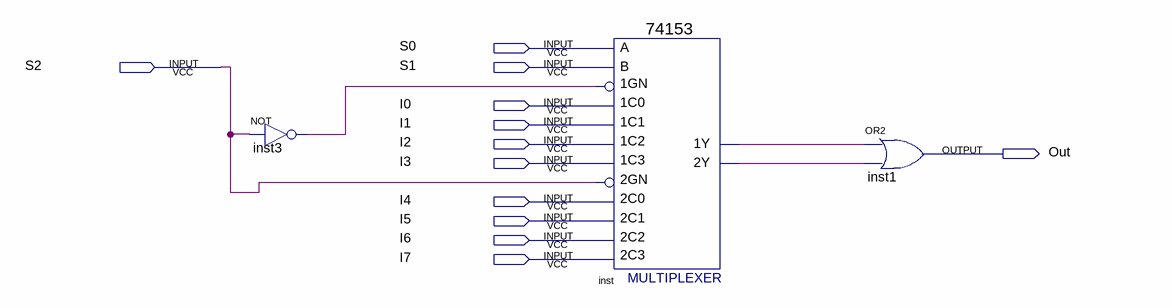
[diagram p0: schematic sheet]
// Quartus schematic MuxDemo_8.bdf as structural Verilog: 3 symbols, 12 pins
module MuxDemo_8 (
  input  S0,
  input  S2,
  input  S1,
  input  I0,
  input  I1,
  input  I2,
  input  I3,
  input  I4,
  input  I5,
  input  I6,
  input  I7,
  output Out
);

  wire inst3_out, inst_1y, inst_2y;

  not inst3 (inst3_out, S2);
  \74153  inst (
    .\1C1 (I1), .\1GN (inst3_out), .\1C0 (I0), .\2C0 (I4), .\2GN (S2), .\2C2 (I6), .\1C2 (I2), .\1C3 (I3),
    .B(S1), .A(S0), .\2C1 (I5), .\2C3 (I7), .\1Y (inst_1y), .\2Y (inst_2y));
  or inst1 (Out, inst_1y, inst_2y);
endmodule
